# EAGLE design LED_Chevron (EAGLE 9.1.0)
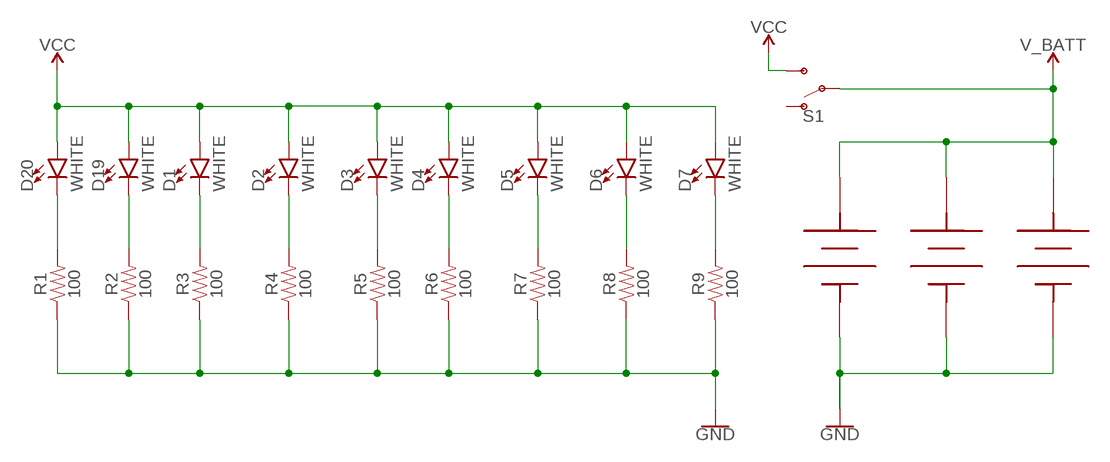
[diagram p0: schematic, sheet 1]

## Parts
D1  WHITE  LED-WHITE1206  [LED-1206]
D2  WHITE  LED-WHITE1206  [LED-1206]
D3  WHITE  LED-WHITE1206  [LED-1206]
D4  WHITE  LED-WHITE1206  [LED-1206]
D5  WHITE  LED-WHITE1206  [LED-1206]
D6  WHITE  LED-WHITE1206  [LED-1206]
D7  WHITE  LED-WHITE1206  [LED-1206]
D19  WHITE  LED-WHITE1206  [LED-1206]
D20  WHITE  LED-WHITE1206  [LED-1206]
R1  100  100OHM-0603-1/4W-5%  [0603]
R2  100  100OHM-0603-1/4W-5%  [0603]
R3  100  100OHM-0603-1/4W-5%  [0603]
R4  100  100OHM-0603-1/4W-5%  [0603]
R5  100  100OHM-0603-1/4W-5%  [0603]
R6  100  100OHM-0603-1/4W-5%  [0603]
R7  100  100OHM-0603-1/4W-5%  [0603]
R8  100  100OHM-0603-1/4W-5%  [0603]
R9  100  100OHM-0603-1/4W-5%  [0603]
S1  SWITCH-SPDT-SMD-RIGHT-ANGLE  [SWITCH_SPST_SMD_A]
U$1  7.8MM_COIN_CELL_BATTERY  [7.8MM_COIN_CELL_BATT]
U$2  7.8MM_COIN_CELL_BATTERY  [7.8MM_COIN_CELL_BATT]
U$3  7.8MM_COIN_CELL_BATTERY  [7.8MM_COIN_CELL_BATT]

## Nets
GND: R1.1 R2.1 R3.1 R4.1 R5.1 R6.1 R7.1 R8.1 R9.1 U$1.GND(BATT-) U$2.GND(BATT-) U$3.GND(BATT-)
N$1: D20.C R1.2
N$2: D19.C R2.2
N$3: D1.C R3.2
N$4: D2.C R4.2
N$5: D3.C R5.2
N$6: D4.C R6.2
N$7: D5.C R7.2
N$8: D6.C R8.2
N$9: D7.C R9.2
V_BATT: S1.2(P) U$1.P$3(BATT+) U$1.VBATT+(BATT+) U$2.P$3(BATT+) U$2.VBATT+(BATT+) U$3.P$3(BATT+) U$3.VBATT+(BATT+)
VCC: D1.A D2.A D3.A D4.A D5.A D6.A D7.A D19.A D20.A S1.3(S)
Unconnected: S1.1(O)

## Library data of the parts
D1-D7 D19 D20 = SparkFun-LED:LED-WHITE: White SMD LED Used in manufacturing several products at SparkFun. Packages: 0603 - Bright White SMD 0603 package[Product Link] <http://www.kingbrightusa.com/product.asp?catalog_name=LED&product_id=APT1608QWF/D> 1206 - Bright White SMD1206 package [Product Link] <http://www.kingbrightusa.com/product.asp?catalog_name=LED&product_id=APT3216QWF/D> 3014 - Super Bright SMD 3014 package [Datasheet] <http://www.lumileds.com/uploads/459/DS208-pdf> SparkFun Products: Blackberry Trackballer Breakout <https://www.sparkfun.com/products/13169> Digital SandBox <https://www.sparkfun.com/products/12651>; PROD_ID: DIO-09955
R1-R9 = SparkFun-Resistors:100OHM: 100Ω resistor A resistor is a passive two-terminal electrical component that implements electrical resistance as a circuit element. Resistors act to reduce current flow, and, at the same time, act to lower voltage levels within circuits. - Wikipedia; PROD_ID: RES-12438
S1 = SparkFun-Switches:SWITCH-SPDT: Single Pole, Double Throw (SPDT) Switch Single-pole, double-throw (SPDT) switch. Variant Overview SMD-AYZ0202 Surface Mount DPDT Switch <https://www.sparkfun.com/products/597> (COM-00597) Used on e.g. LilyPad Arduino USB - ATmega32U4 Board <https://www.sparkfun.com/products/12049> PTH-11.6X4.0MM SPDT Mini Power Switch <https://www.sparkfun.com/products/102> (COM-00102) Used on e.g. SparkFun Simon Says - Through-Hole Soldering Kit <https://www.sparkfun.com/products/10547> (KIT-10547) PTH-11.6X4.0MM-KIT KIT version of SPDT Mini Power Switch - Simplifies soldering by removing tStop of switch pins - only one side can be soldered. PTH-11.6X4.0MM-LOCK LOCK version of SPDT Mini Power Switch - Offset pins hold switch in place for easier soldering. SMD-RIGHT-ANGLE Surface Mount Right Angle Switch <https://www.sparkfun.com/products/10860> (COM-10860) Used on e.g. SparkFun ESP8266 Thing <https://www.sparkfun.com/products/13231>; PROD_ID: SWCH-10651; SF_SKU: COM-10860
U$1-U$3 = 7.9MM_COIN_CELL_BATTERY:7.8MM_COIN_CELL_BATTERY; PARTNO: 36-2989-ND; VENDOR: DIGIKEY

## Board
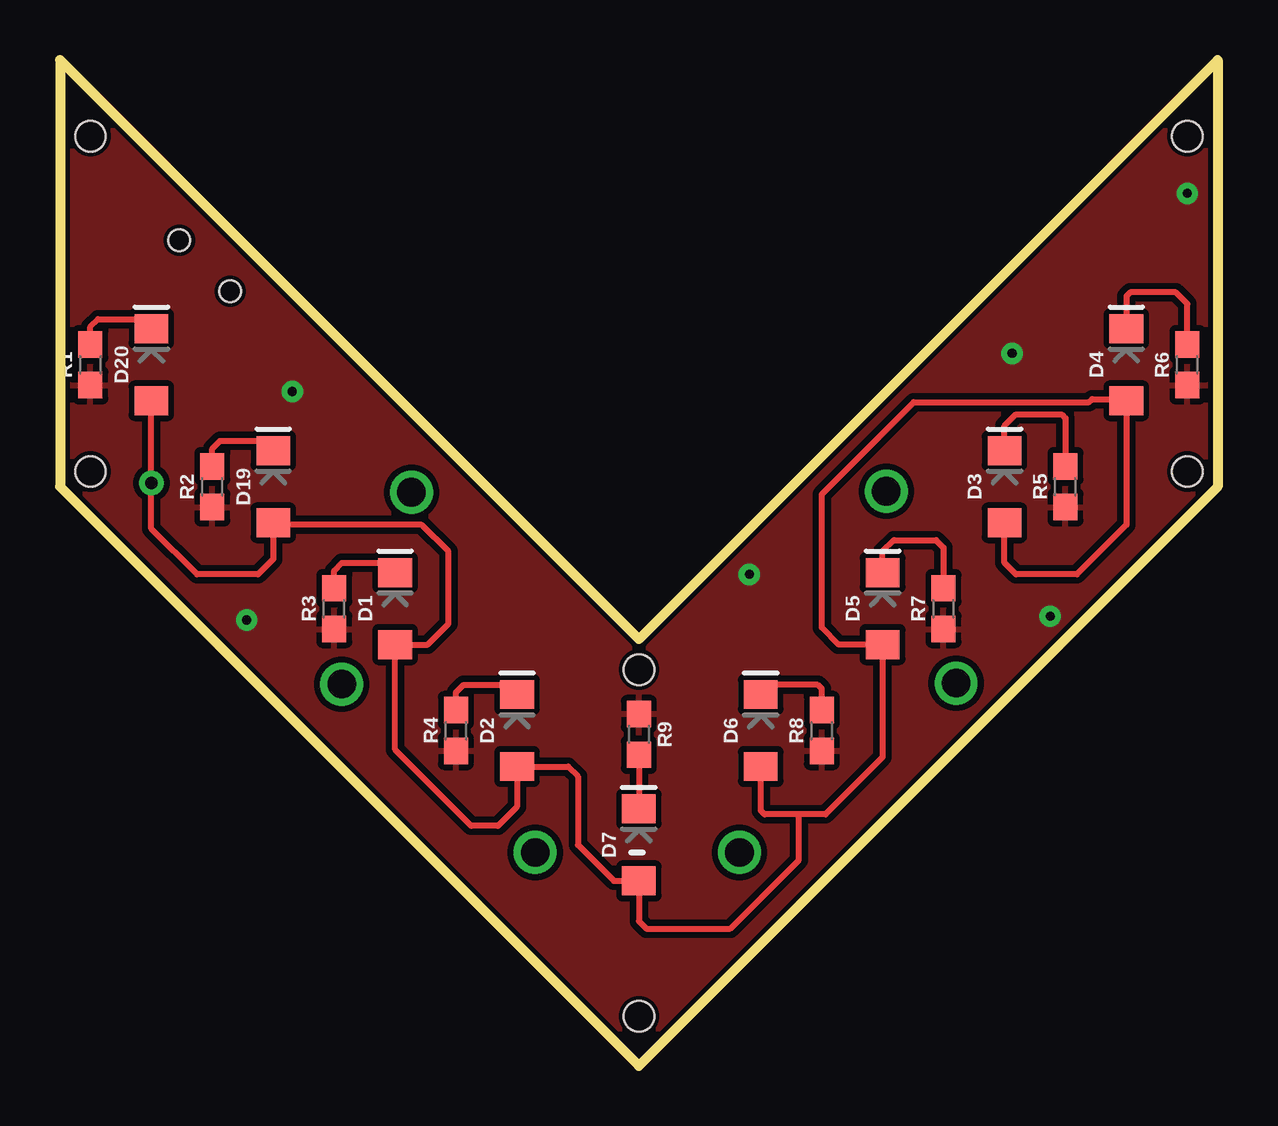
[diagram p1: board, top side]
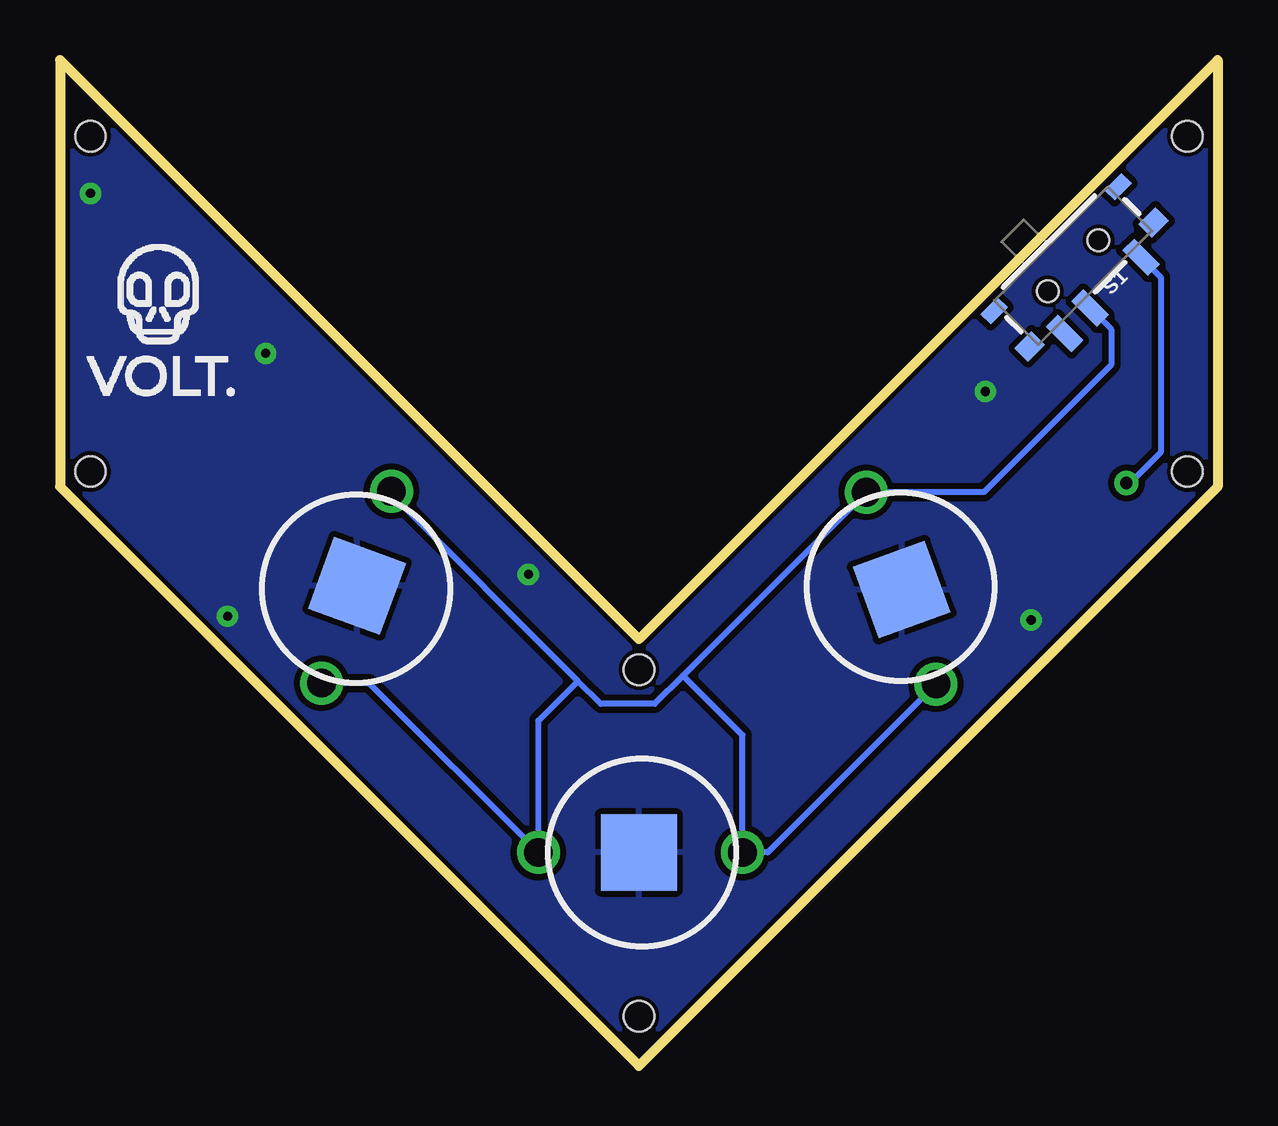
[diagram p2: board, bottom side, seen from below]

Size 48.26 x 41.91 mm. Coordinates in mm from the lower left corner, seen from the top.
Outline: 0,41.91 0,24.13 24.13,0 48.26,24.13 48.26,41.91 24.13,17.78 0,41.91
Copper layers (1*16): Top 0.035mm / dielectric 1.5mm / Bottom 0.035mm
Design rules "SparkFun-2-layer-STANDARD": minimum track width 10mil, minimum drill 20mil, track to track 10mil, track to pad 8mil, pad to pad 8mil, via to via 10mil, smd to smd 8mil, copper to edge 8mil, drill to drill 8mil, minimum pad ring 10mil, minimum via ring 10mil, stop-mask expansion 4mil, vias tented up to drill 25mil, thermal gap 10mil
Holes 1.27 mm at 1.27,38.73 1.27,24.77 46.99,24.77 46.99,38.73 24.13,2.06 24.13,16.51

### Footprints (pad centres in the part's own frame; a part is rotated, then mirrored left to right if it is on the bottom)
LED-1206 = smd 1.2 x 1.4: A -1.5,0; C 1.5,0
0603 = smd 1.1 x 1: 1 -0.85,0; 2 0.85,0
SWITCH_SPST_SMD_A = smd 0.7 x 1.5: 1 -2.25,-1.75; 2 -0.75,-1.75; 3 2.25,-1.75 | smd 1 x 0.6: GND1 -3.65,1; GND3 3.65,1 | smd 1 x 0.8: GND2 -3.65,-1.1; GND4 3.65,-1.1 | hole 0.9: -1.5,0; 1.5,0
7.8MM_COIN_CELL_BATT = smd 3.175 x 3.175: GND 0,0 | drill 1.194: P$3 4.318,0; VBATT+ -4.191,0

### Placement (x,y rotation side)
D1  13.97,19.05 90 top
D2  19.05,13.97 90 top
D3  39.37,24.13 90 top
D4  44.45,29.21 90 top
D5  34.29,19.05 90 top
D6  29.21,13.97 90 top
D7  24.13,9.21 90 top
D19  8.89,24.13 90 top
D20  3.81,29.21 90 top
R1  1.27,29.21 90 top
R2  6.35,24.13 90 top
R3  11.43,19.05 90 top
R4  16.51,13.97 90 top
R5  41.91,24.13 90 top
R6  46.99,29.21 90 top
R7  36.83,19.05 90 top
R8  31.75,13.97 90 top
R9  24.13,13.81 270 top
S1  6.03,33.34 45 bottom
U$1  13.18,19.84 110 bottom
U$2  24.13,8.89 0 bottom
U$3  35.88,20 250 bottom
U$5  [VOLT##LOGO#WHITE_#1##PNG]  43.97,30.64 0 bottom

### Tracks (layer width: path | path; a pad name or v marks a point on that pad's centre or on a via)
GND  (via drill 0.38)
  other vias: 9.68,28.1 7.78,18.57 41.27,18.73 39.69,29.69 46.99,36.35 28.73,20.48
  pour Top: 0,41.91 0,24.13 24.13,0 48.26,24.13 48.26,41.91 24.13,17.78
  pour Bottom: 0,41.91 0,24.13 24.13,0 48.26,24.13 48.26,41.91 24.13,17.78
N$1
  Top 0.254: R1.2 1.27,30.8 1.59,31.11 3.4,31.11 D20.C
N$2
  Top 0.254: R2.2 6.35,25.72 6.67,26.04 8.49,26.04 D19.C
N$3
  Top 0.254: R3.2 11.43,20.64 11.75,20.95 13.57,20.95 D1.C
N$4
  Top 0.254: R4.2 16.51,15.56 16.83,15.88 18.64,15.88 D2.C
N$5
  Top 0.254: D3.C 39.37,26.67 39.85,27.15 41.75,27.15 41.91,26.99 R5.2
N$6
  Top 0.254: D4.C 44.45,32.07 44.61,32.23 46.51,32.23 46.99,31.75 R6.2
N$7
  Top 0.254: D5.C 34.29,21.43 34.77,21.91 36.51,21.91 36.83,21.59 R7.2
N$8
  Top 0.254: D6.C 29.62,15.88 31.59,15.88 31.75,15.72 R8.2
N$9
  Top 0.254: R9.2 D7.C
V_BATT
  Bottom 0.254: S1.2 4.45,30.69 4.45,29.21 9.75,23.9 10.32,23.9 U$1.P$3 22.29,16.26 | U$1.VBATT+ 18.76,8.89 U$2.P$3 19.81,13.78 22.29,16.26 | 22.29,16.26 23.47,15.08 25.72,15.08 26.67,16.03 | 26.67,16.03 34.44,23.81 U$3.VBATT+ | U$3.P$3 35.38,15.95 U$2.VBATT+ 28.32,14.38 26.67,16.03
VCC  (via drill 0.51)
  Top 0.254: D20.A v3.81,24.29 3.81,22.38 5.71,20.48 8.26,20.48 8.89,21.11 8.89,22.54 | D3.A 39.37,20.95 39.85,20.48 42.39,20.48 44.45,22.54 D4.A 44.38,27.78 43.02,27.78 42.89,27.65 35.59,27.65 31.75,23.81 31.75,18.26 32.46,17.55 D5.A 34.29,12.86 31.91,10.48 30.8,10.48 | 30.8,10.48 29.37,10.48 29.21,10.64 D6.A | 30.8,10.48 30.8,8.57 27.94,5.71 24.45,5.71 24.13,6.03 D7.A 23.09,7.71 21.59,9.21 21.59,12.07 21.18,12.47 D2.A 19.05,10.8 18.26,10 17.14,10 13.97,13.18 D1.A 15.33,17.55 16.19,18.41 16.19,21.43 15.08,22.54 8.89,22.54 | D19.A 8.89,22.54
  Bottom 0.254: S1.3 2.38,32.87 2.38,25.56 3.81,24.13 v3.81,24.29